# EAGLE design Self_Balancing_Remote (EAGLE 9.6.2)
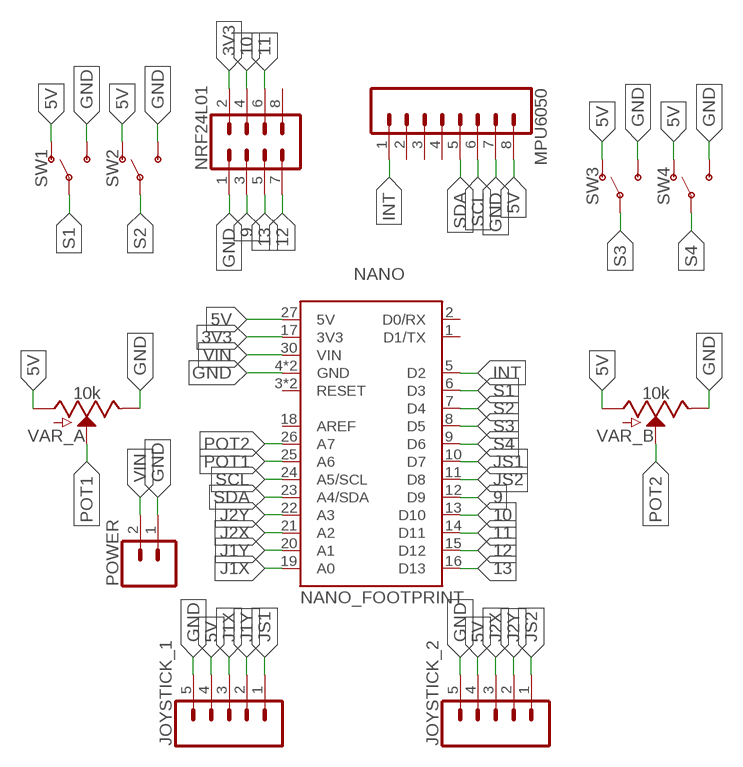
[diagram p0: schematic, sheet 1]

## Parts
JOYSTICK_1  CONN_05  [1X05]
JOYSTICK_2  CONN_05  [1X05]
MPU6050  CONN_08"  [1X08]
NANO  NANO_FOOTPRINT  [NANO]
NRF24L01  CONN_04X2  [2X4]
POWER  CONN_02  [1X02]
SW1  SWITCH-SPDT-PTH-8.6X4.3MM  [SWITCH_SPDT_8.6X4.3MM]
SW2  SWITCH-SPDT-PTH-8.6X4.3MM  [SWITCH_SPDT_8.6X4.3MM]
SW3  SWITCH-SPDT-PTH-8.6X4.3MM  [SWITCH_SPDT_8.6X4.3MM]
SW4  SWITCH-SPDT-PTH-8.6X4.3MM  [SWITCH_SPDT_8.6X4.3MM]
VAR_A  10k  POTENTIOMETER-PTH-9MM-1/20W-20%-KIT  [POT-PTH-ALPS-KIT]
VAR_B  10k  POTENTIOMETER-PTH-9MM-1/20W-20%-KIT  [POT-PTH-ALPS-KIT]

## Nets
3V3: NANO.17(3V3) NRF24L01.2
5V: JOYSTICK_1.4 JOYSTICK_2.4 MPU6050.8 NANO.27(5V) SW1.1(O) SW2.1(O) SW3.1(O) SW4.1(O) VAR_A.P$3(A) VAR_B.P$3(A)
9: NANO.12(D9) NRF24L01.3
10: NANO.13(D10) NRF24L01.4
11: NANO.14(D11) NRF24L01.6
12: NANO.15(D12) NRF24L01.7
13: NANO.16(D13) NRF24L01.5
GND: JOYSTICK_1.5 JOYSTICK_2.5 MPU6050.7 NANO.4(GND) NANO.29(GND) NRF24L01.1 POWER.1 SW1.3(S) SW2.3(S) SW3.3(S) SW4.3(S) VAR_A.P$1(E) VAR_B.P$1(E)
INT: MPU6050.1 NANO.5(D2)
J1X: JOYSTICK_1.3 NANO.19(A0)
J1Y: JOYSTICK_1.2 NANO.20(A1)
J2X: JOYSTICK_2.3 NANO.21(A2)
J2Y: JOYSTICK_2.2 NANO.22(A3)
JS1: JOYSTICK_1.1 NANO.10(D7)
JS2: JOYSTICK_2.1 NANO.11(D8)
POT1: NANO.25(A6) VAR_A.P$2(S)
POT2: NANO.26(A7) VAR_B.P$2(S)
S1: NANO.6(D3) SW1.2(P)
S2: NANO.7(D4) SW2.2(P)
S3: NANO.8(D5) SW3.2(P)
S4: NANO.9(D6) SW4.2(P)
SCL: MPU6050.6 NANO.24(A5/SCL)
SDA: MPU6050.5 NANO.23(A4/SDA)
VIN: NANO.30(VIN) POWER.2
Unconnected: MPU6050.2 MPU6050.3 MPU6050.4 NANO.1(D1/TX) NANO.2(D0/RX) NANO.3(RESET) NANO.18(AREF) NANO.28(RESET) NRF24L01.8

## Library data of the parts
JOYSTICK_1 JOYSTICK_2 = SparkFun-Connectors:CONN_05: Multi connection point. Often used as Generic Header-pin footprint for 0.1 inch spaced/style header connections On any of the 0.1 inch spaced packages, you can populate with these: Break Away Headers - Straight <https://www.sparkfun.com/products/116> (PRT-00116) Break Away Male Headers - Right Angle <https://www.sparkfun.com/products/553> (PRT-00553) Female Headers <https://www.sparkfun.com/products/115> (PRT-00115) Break Away Headers - Machine Pin <https://www.sparkfun.com/products/117> (PRT-00117) Break Away Female Headers - Swiss Machine Pin <https://www.sparkfun.com/products/743> (PRT-00743) For SCREWTERMINALS and SPRING TERMINALS visit here: Screw Terimnals on SparkFun.com <https://www.sparkfun.com/search/results?term=Screw+Terminals> (5mm/3.5mm/2.54mm spacing) This device is also useful as a general connection point to wire up your design to another part of your project. Our various solder wires solder well into these plated through hole pads. Hook-Up Wire - Assortment (Stranded, 22 AWG) <https://www.sparkfun.com/products/11375> (PRT-11375) Hook-Up Wire - Assortment (Solid Core, 22 AWG) <https://www.sparkfun.com/products/11367> (PRT-11367) View the entire wire category on our website here <https://www.sparkfun.com/categories/141> Special notes: Molex polarized connector foot print use with SKU : PRT-08231 with associated crimp pins and housings. 1MM SMD Version SKU: PRT-10208
MPU6050 = SparkFun-Connectors:CONN_08: Multi connection point. Often used as Generic Header-pin footprint for 0.1 inch spaced/style header connections On any of the 0.1 inch spaced packages, you can populate with these: Break Away Headers - Straight <https://www.sparkfun.com/products/116> (PRT-00116) Break Away Male Headers - Right Angle <https://www.sparkfun.com/products/553> (PRT-00553) Female Headers <https://www.sparkfun.com/products/115> (PRT-00115) Break Away Headers - Machine Pin <https://www.sparkfun.com/products/117> (PRT-00117) Break Away Female Headers - Swiss Machine Pin <https://www.sparkfun.com/products/743> (PRT-00743) Arduino Stackable Header - 8 Pin <https://www.sparkfun.com/products/9279> (PRT-09279) For SCREWTERMINALS and SPRING TERMINALS visit here: Screw Terimnals on SparkFun.com <https://www.sparkfun.com/search/results?term=Screw+Terminals> (5mm/3.5mm/2.54mm spacing) This device is also useful as a general connection point to wire up your design to another part of your project. Our various solder wires solder well into these plated through hole pads. Hook-Up Wire - Assortment (Stranded, 22 AWG) <https://www.sparkfun.com/products/11375> (PRT-11375) Hook-Up Wire - Assortment (Solid Core, 22 AWG) <https://www.sparkfun.com/products/11367> (PRT-11367) View the entire wire category on our website here <https://www.sparkfun.com/categories/141> Special notes: Molex polarized connector foot print use with SKU : PRT-08231 with associated crimp pins and housings. 1MM SMD Version SKU: PRT-10208 NOTES ON THE VARIANTS LOCK and LOCK_LONGPADS... This footprint was designed to help hold the alignment of a through-hole component (i.e. 6-pin header) while soldering it into place. You may notice that each hole has been shifted either up or down by 0.005 of an inch from it's more standard position (which is a perfectly straight line). This slight alteration caused the pins (the squares in the middle) to touch the edges of the holes. Because they are alternating, it causes a "brace" to hold the component in place. 0.005 has proven to be the perfect amount of "off-center" position when using our standard breakaway headers. Although looks a little odd when you look at the bare footprint, once you have a header in there, the alteration is very hard to notice. Also,if you push a header all the way into place, it is covered up entirely on the bottom side.; PROD_ID: CONN-08438
NANO = SparkFun-Boards:NANO_FOOTPRINT: Generic Nano Footprint
NRF24L01 = SparkFun-Connectors:CONN_04X2: Multi connection point. Often used as Generic Header-pin footprint for 0.1 inch spaced/style header connections On any of the 0.1 inch spaced packages, you can populate with these: Break Away Headers - Straight <https://www.sparkfun.com/products/116> (PRT-00116) Break Away Male Headers - Right Angle <https://www.sparkfun.com/products/553> (PRT-00553) Female Headers <https://www.sparkfun.com/products/115> (PRT-00115) Break Away Headers - Machine Pin <https://www.sparkfun.com/products/117> (PRT-00117) Break Away Female Headers - Swiss Machine Pin <https://www.sparkfun.com/products/743> (PRT-00743)
POWER = SparkFun-Connectors:CONN_02: Multi connection point. Often used as Generic Header-pin footprint for 0.1 inch spaced/style header connections On any of the 0.1 inch spaced packages, you can populate with these: Break Away Headers - Straight <https://www.sparkfun.com/products/116> (PRT-00116) Break Away Male Headers - Right Angle <https://www.sparkfun.com/products/553> (PRT-00553) Female Headers <https://www.sparkfun.com/products/115> (PRT-00115) Break Away Headers - Machine Pin <https://www.sparkfun.com/products/117> (PRT-00117) Break Away Female Headers - Swiss Machine Pin <https://www.sparkfun.com/products/743> (PRT-00743) For SCREWTERMINALS and SPRING TERMINALS visit here: Screw Terimnals on SparkFun.com <https://www.sparkfun.com/search/results?term=Screw+Terminals> (5mm/3.5mm/2.54mm spacing) This device is also useful as a general connection point to wire up your design to another part of your project. Our various solder wires solder well into these plated through hole pads. Hook-Up Wire - Assortment (Stranded, 22 AWG) <https://www.sparkfun.com/products/11375> (PRT-11375) Hook-Up Wire - Assortment (Solid Core, 22 AWG) <https://www.sparkfun.com/products/11367> (PRT-11367) View the entire wire category on our website here <https://www.sparkfun.com/categories/141> Special notes: Molex polarized connector foot print use with: PRT-08233 with associated crimp pins and housings. 2.54_SCREWTERM for use with PRT-10571. 3.5mm Screw Terminal footprints for PRT-08084 5mm Screw Terminal footprints for use with PRT-08432
SW1-SW4 = SparkFun-Switches:SWITCH-SPDT: Single Pole, Double Throw (SPDT) Switch Single-pole, double-throw (SPDT) switch. Variant Overview SMD-AYZ0202 Surface Mount DPDT Switch <https://www.sparkfun.com/products/597> (COM-00597) Used on e.g. LilyPad Arduino USB - ATmega32U4 Board <https://www.sparkfun.com/products/12049> PTH-11.6X4.0MM SPDT Mini Power Switch <https://www.sparkfun.com/products/102> (COM-00102) Used on e.g. SparkFun Simon Says - Through-Hole Soldering Kit <https://www.sparkfun.com/products/10547> (KIT-10547) PTH-11.6X4.0MM-KIT KIT version of SPDT Mini Power Switch - Simplifies soldering by removing tStop of switch pins - only one side can be soldered. PTH-11.6X4.0MM-LOCK LOCK version of SPDT Mini Power Switch - Offset pins hold switch in place for easier soldering. SMD-RIGHT-ANGLE Surface Mount Right Angle Switch <https://www.sparkfun.com/products/10860> (COM-10860) Used on e.g. SparkFun ESP8266 Thing <https://www.sparkfun.com/products/13231>; PROD_ID: SWCH-14746
VAR_A VAR_B = SparkFun-Resistors:POTENTIOMETER: Potentiometer (Pot) Three-terminal potentiometers, with an adjustable wiper and two adjustable resistors. A pot can be used to create a configurable voltage divider, or as a variable resistor. Variants ALPS_POT and ALPS_POT_KIT - PTH, breadboard compatible, 9mm square pots Rotary Potentiometer - Linear (10k ohm) <https://www.sparkfun.com/products/9288> (COM-09288) The KIT variant exposes copper on only one side of the PTH pad, so the part can only be assembled on one side of the PCB. Useful for beginner soldering kits.; PROD_ID: RES-09177; SF_SKU: COM-09288

## Board
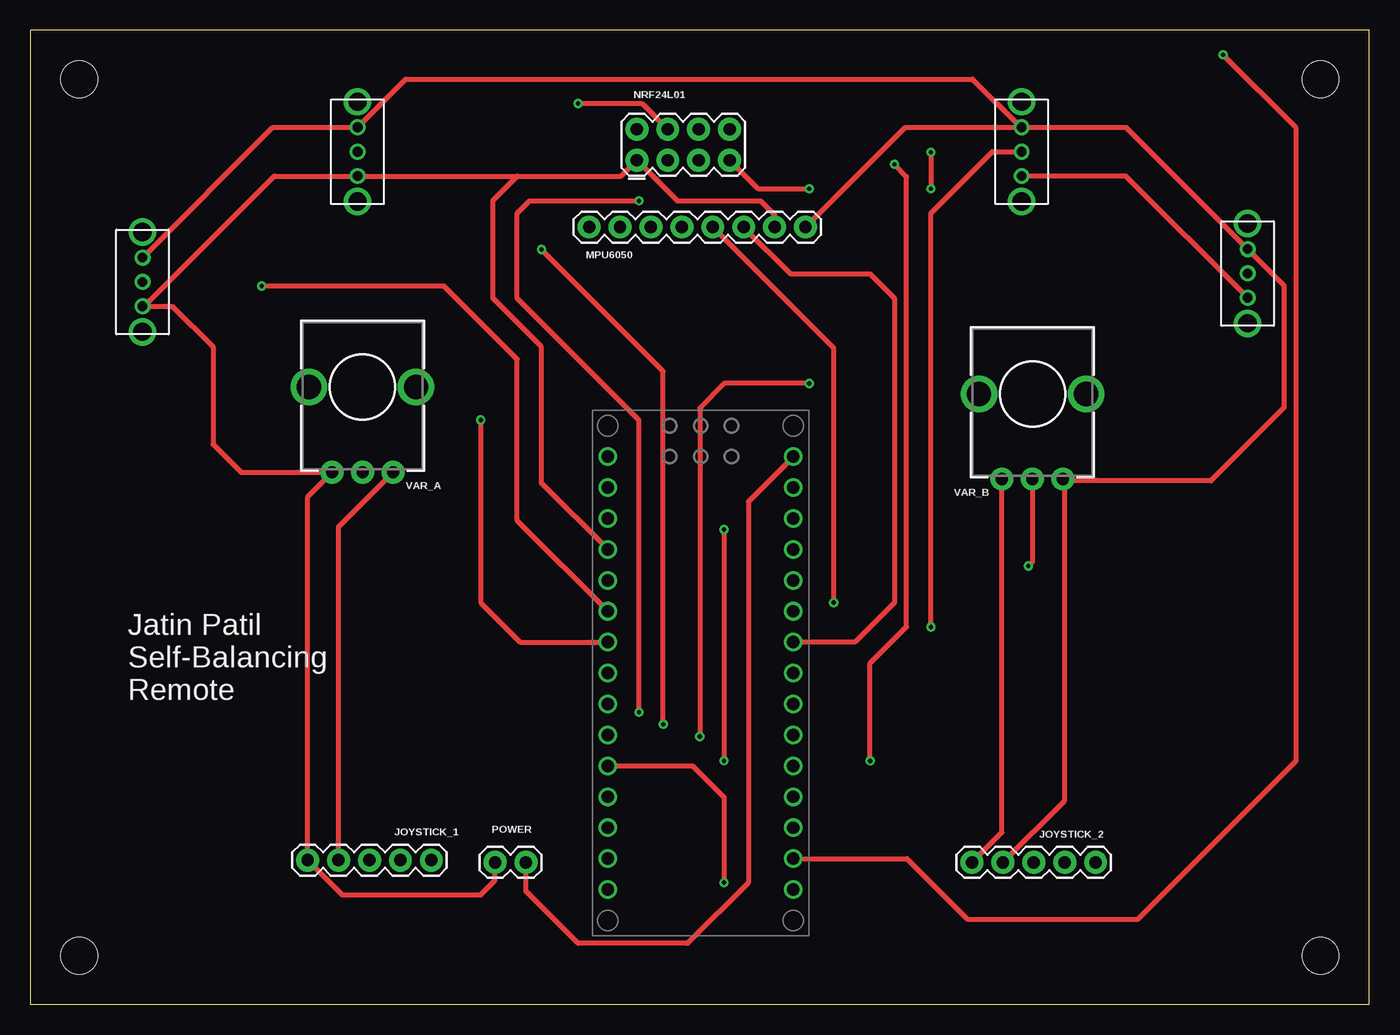
[diagram p1: board, top side]
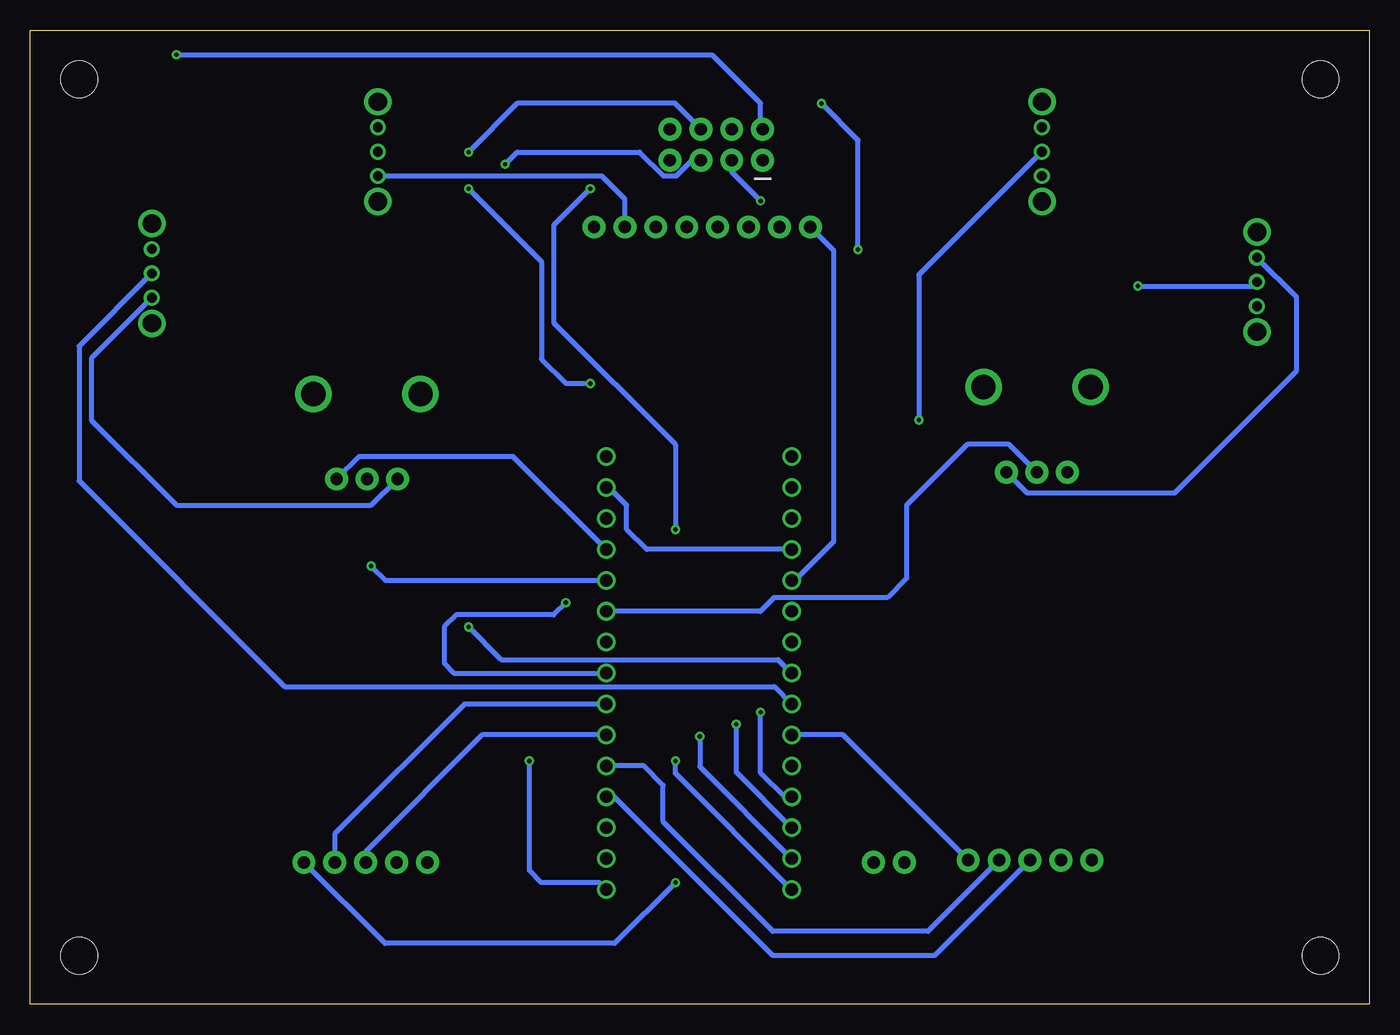
[diagram p2: board, bottom side, seen from below]

Size 110 x 80 mm. Coordinates in mm from the lower left corner, seen from the top.
Outline: 0,0 110,0 110,80 0,80 0,0
Copper layers (1*16): Top 0.035mm / dielectric 1.5mm / Bottom 0.035mm
Design rules "default": minimum track width 6mil, minimum drill 0.35mm, track to track 6mil, track to pad 6mil, pad to pad 6mil, via to via 6mil, smd to smd 6mil, copper to edge 40mil, drill to drill 6mil, minimum pad ring 10mil, minimum via ring 8mil, stop-mask expansion 4mil, vias tented up to drill 0mil, thermal gap 10mil
Holes 3 mm at 4,76 106,76 4,4 106,4

### Footprints (pad centres in the part's own frame; a part is rotated, then mirrored left to right if it is on the bottom)
1X05 = drill 1.016 pad 1.88: 1 0,0; 2 2.54,0; 3 5.08,0; 4 7.62,0; 5 10.16,0
1X08 = drill 1.016 pad 1.88: 1 0,0; 2 2.54,0; 3 5.08,0; 4 7.62,0; 5 10.16,0; 6 12.7,0; 7 15.24,0; 8 17.78,0
NANO = drill 1.016: 1 -7.62,17.78; 2 -7.62,15.24; 3 -7.62,12.7; 4 -7.62,10.16; 5 -7.62,7.62; 6 -7.62,5.08; 7 -7.62,2.54; 8 -7.62,0; 9 -7.62,-2.54; 10 -7.62,-5.08; 11 -7.62,-7.62; 12 -7.62,-10.16; 13 -7.62,-12.7; 14 -7.62,-15.24; 15 -7.62,-17.78; 16 7.62,-17.78; 17 7.62,-15.24; 18 7.62,-12.7; 19 7.62,-10.16; 20 7.62,-7.62; 21 7.62,-5.08; 22 7.62,-2.54; 23 7.62,0; 24 7.62,2.54; 25 7.62,5.08; 26 7.62,7.62; 27 7.62,10.16; 28 7.62,12.7; 29 7.62,15.24; 30 7.62,17.78
2X4 = drill 1.016 pad 1.88: 1 -3.81,-1.27; 2 -3.81,1.27; 3 -1.27,-1.27; 4 -1.27,1.27; 5 1.27,-1.27; 6 1.27,1.27; 7 3.81,-1.27; 8 3.81,1.27
1X02 = drill 1.016 pad 1.88: 1 0,0; 2 2.54,0
SWITCH_SPDT_8.6X4.3MM = drill 0.8: 1 -2,0; 2 0,0; 3 2,0 | drill 1.5: 4 -4.1,0; 5 4.1,0
POT-PTH-ALPS-KIT = drill 1 pad 1.88: P$1 7,-2.5; P$2 7,0; P$3 7,2.5 | drill 2: P$4 0,-4.4; P$5 0,4.4

### Placement (x,y rotation side)
JOYSTICK_1  32.94,11.85 180 top
JOYSTICK_2  87.53,11.66 180 top
MPU6050  45.91,63.85 0 top
NANO  55.07,27.21 0 top
NRF24L01  53.64,70.61 0 top
POWER  38.18,11.66 0 top
SW1  9.21,59.34 270 top
SW2  26.88,70.04 270 top
SW3  81.45,70.04 270 top
SW4  100.02,60.04 270 top
VAR_A  27.29,50.7 270 top
VAR_B  82.34,50.15 270 top

### Tracks (layer width: path | path; a pad name or v marks a point on that pad's centre or on a via)
3V3  (via drill 0.35)
  Top 0.4: NANO.17 72.03,11.97 77,7 91,7 104,20 104,72 v98,78
  Bottom 0.4: NRF24L01.2 50,72.05 50,74 54,78 v98,78
  other vias: 62.69,11.97
5V
  Top 0.4: SW1.1 19.91,72.04 SW2.1 30.84,76 77.41,76 81.41,72 | 84.99,43 97,43 103,49 103,59.06 SW4.1 90.02,72.04 SW3.1 81.41,72 | 84.99,43 VAR_B.P$3 | MPU6050.8 71.84,72 81.41,72 | JOYSTICK_1.4 25.32,39.23 VAR_A.P$3 | JOYSTICK_2.4 84.99,16.74 84.99,43
  Bottom 0.4: SW1.1 6,58.13 6,52 16,42 28.09,42 VAR_A.P$3 | NANO.27 70.32,45 83,45 VAR_B.P$3
9  (via drill 0.35)
  Top 0.4: v50,24 50,48 40,58 40,65 41,66 v50,66
  Bottom 0.4: NANO.12 48.05,17.05 50,19 v50,24 | v50,66 52.37,68.37 NRF24L01.3
10  (via drill 0.35)
  Top 0.4: v52,23 52,52 v42,62 | v45,74 50.25,74 NRF24L01.4
  Bottom 0.4: NANO.13 52,19.06 v52,23 | v42,62 42,71 v45,74
11  (via drill 0.35)
  Top 0.4: v74,70 v74,67 | v64,51 57,51 55,49 v55,22
  Bottom 0.4: NRF24L01.6 57.03,74 70,74 v74,70 | v74,67 68,61 68,53 66,51 v64,51 | v55,22 55,19.52 NANO.14
12  (via drill 0.35)
  Top 0.4: NRF24L01.7 59.79,67 v64,67 | v57,39 v57,20
  Bottom 0.4: v64,67 67,64 67,56 57,46 v57,39 | NANO.15 57,18.98 v57,20
13  (via drill 0.35)
  Top 0.4: v69,20 69,28 72,31 72,68 v71,69
  Bottom 0.4: NANO.16 63.26,10 68,10 69,11 v69,20 | v71,69 70,70 59.94,70 57.98,68.05 56.91,68.05 55.62,69.34 NRF24L01.5
GND
  Top 0.4: SW4.3 90.02,68.04 SW3.3 | 40,68.04 SW2.3 20.04,68.04 9.34,57.34 SW1.3 11.66,57.34 15,54 15,46 17.3,43.7 VAR_A.P$1 22.78,41.69 JOYSTICK_1.5 25.63,9 37,9 38.18,10.18 POWER.1 | JOYSTICK_2.5 79.84,14.13 VAR_B.P$1 | MPU6050.7 61.15,64.85 60,66 53.17,66 NRF24L01.1 48.53,68.04 40,68.04 | 40,68.04 38,66.04 38,58 42,54 42,42.82 NANO.4
  Bottom 0.4: MPU6050.7 61.15,66.15 63.04,68.04 SW3.3 | SW4.3 105,53.06 105,48 98,41 81.99,41 VAR_B.P$1 | NANO.4 59.37,37.37 61,39 61,41 62.45,42.45 NANO.29
INT
  Bottom 0.4: MPU6050.1 44,61.94 44,38 47.17,34.83 NANO.5
J1X
  Bottom 0.4: JOYSTICK_1.3 35.71,4 49,4 62.05,17.05 NANO.19
J1Y
  Bottom 0.4: JOYSTICK_1.2 36.25,6 49,6 58,15 58,18 59.59,19.59 NANO.20
J2X
  Bottom 0.4: NANO.21 72.87,22.13 82.45,12.55 JOYSTICK_2.3
J2Y
  Bottom 0.4: NANO.22 74.33,24.67 85,14 JOYSTICK_2.2
JS1
  Bottom 0.4: JOYSTICK_1.1 43.22,22.13 NANO.10
JS2  (via drill 0.35)
  Top 0.4: NANO.11 54.41,19.59 57,17 v57,10
  Bottom 0.4: v57,10 62,5 80.87,5 JOYSTICK_2.1
POT1
  Bottom 0.4: VAR_A.P$2 29.59,46 33,46 38,41 38,35 39.6,33.4 48.91,33.4 50.03,32.29 NANO.25
POT2  (via drill 0.35)
  Top 0.4: VAR_B.P$2 82.34,36.34 v82,36
  Bottom 0.4: v82,36 80.83,34.83 NANO.26
S1  (via drill 0.35)
  Top 0.4: NANO.6 40,39.74 40,53 34,59 v19,59
  Bottom 0.4: v19,59 9.55,59 SW1.2
S2  (via drill 0.35)
  Top 0.4: v37,48 37,33 40.25,29.75 NANO.7
  Bottom 0.4: SW2.2 37,59.92 v37,48
S3  (via drill 0.35)
  Top 0.4: v74,31 74,65 79.04,70.04 SW3.2
  Bottom 0.4: v74,31 71.32,28.32 48.56,28.32 NANO.8
S4
  Bottom 0.4: SW4.2 106,54.06 106,43 89.1,26.1 48.88,26.1 NANO.9
SCL
  Top 0.4: MPU6050.6 62.46,60 69,60 71,58 71,33 67.75,29.75 NANO.24
SDA  (via drill 0.35)
  Top 0.4: MPU6050.5 66,53.92 v66,33
  Bottom 0.4: v66,33 67,32 75,32 76,31 76,28 75.21,27.21 NANO.23
VIN
  Top 0.4: NANO.30 59,41.3 59,10 54,5 45,5 40.72,9.28 POWER.2

### Text on the board
tNames: Jatin Patil / Self-Balancing / Remote